# Altium project NXP_FRDM_IMX93.PrjPcb (part 9 of 13)
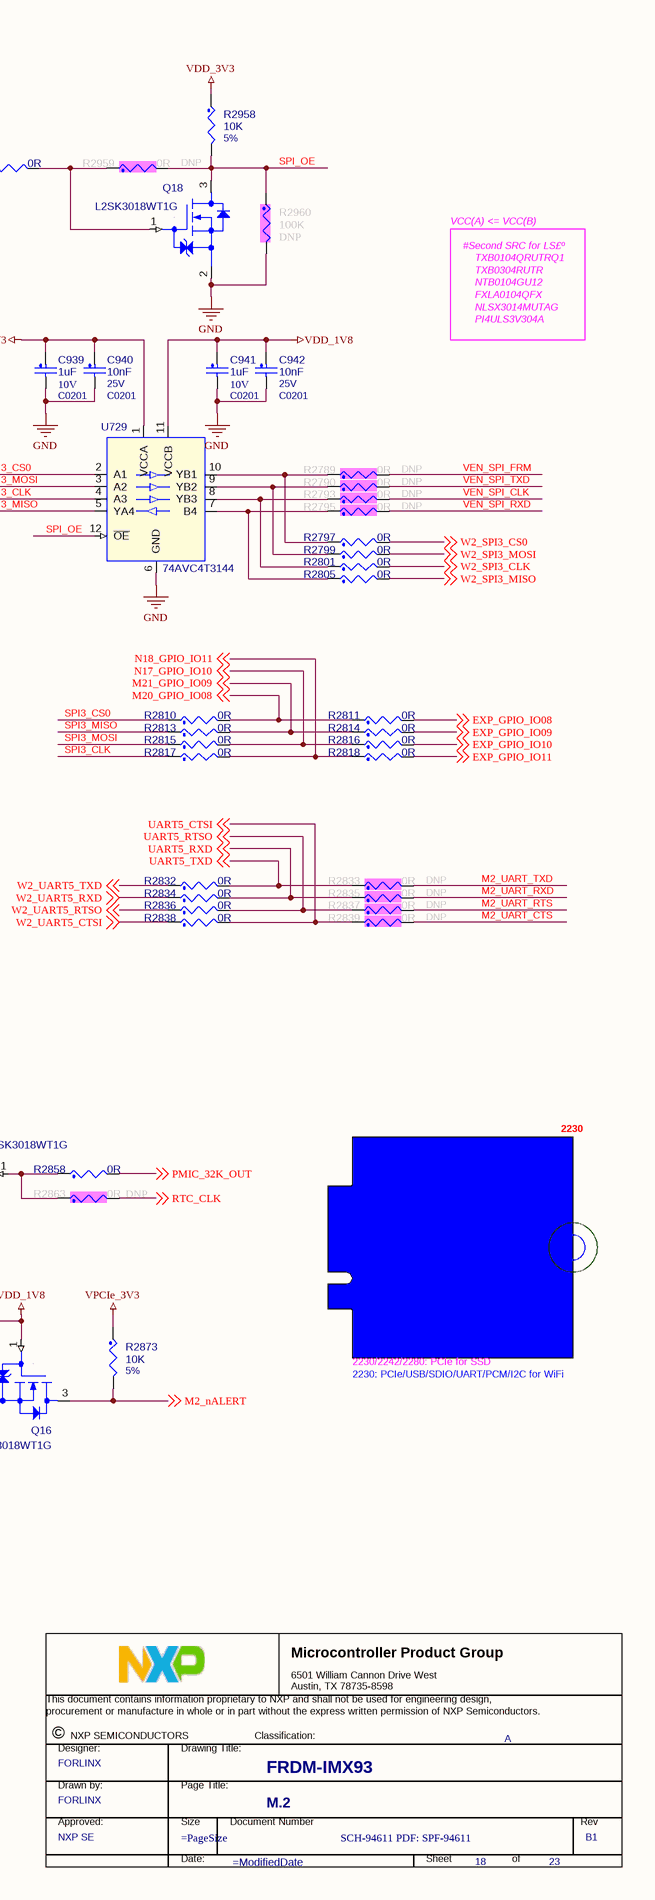
[diagram p44: E-18 M.2.SchDoc, right]

## Sheet E-18 M.2.SchDoc: FRDM-IMX93 (continued)

### Nets
GND: BH1.1 C927.2 C928.2 C930.2 C931.2 C932.2 C934.2 C935.2 C936.2 C937.2 C938.2 C939.2 C940.2 C941.2 C942.2 C943.2 C944.2 C945.2 C946.2 C947.2 C948.2 C949.2 C950.2 P8.1(GND1) P8.7(GND2) P8.18(GND3) P8.33(GND5) P8.39(GND4) P8.45(GND6) P8.51(GND7) P8.57(GND8) P8.63(GND9) P8.69(GND10) P8.75(GND11) Q8.2(SOURCE) Q17.2(SOURCE) Q18.2(SOURCE) R2783.2 R2784.2 R2956.2 R2960.2 U726.10(GND) U728.6(GND) U729.6(GND)
VDD_1V8: C937.1 C938.1 C941.1 C942.1 Q16.1(GATE) R2822.1 R2823.1 R2861.2 R2862.2 R2954.1 U728.11(VCCB) U729.11(VCCB)  [project net LPD4/x_VDD1]
VDD_3V3: C935.1 C936.1 C939.1 C940.1 R2785.1 R2957.1 R2958.1 U728.1(VCCA) U729.1(VCCA)
VDD_5V: C927.1 C928.1 R2786.1 U726.8(VIN1) U726.11(VIN2)
VPCIe_3V3: C929.1 C930.1 C931.1 C932.1 C933.2 C943.1 C944.1 C945.1 C946.1 C947.1 C948.1 C949.1 C950.1 L711.2 P8.2(3V3_1) P8.4(3V3_2) P8.72(3V3_3) P8.74(3V3_4) R2776.1 R2831.2 R2840.2 R2850.1 R2859.2 R2873.1 R3031.2 U726.2(OUT)
A15_USB2_D_N: R2804.1 R2807.1 ; off-sheet A15_USB2_D_N  [project net USB2_DN]
A22_SD3_nWAKE: R2851.1 R2854.1 R2862.1 ; off-sheet A22_SD3_nWAKE  [project net CLKO01]
B15_USB2_D_P: R2803.1 R2806.1 ; off-sheet B15_USB2_D_P  [project net USB2_DP]
EXP_GPIO_IO08: R2811.2 ; off-sheet EXP_GPIO_IO08
EXP_GPIO_IO09: R2814.2 ; off-sheet EXP_GPIO_IO09
EXP_GPIO_IO10: R2816.2 ; off-sheet EXP_GPIO_IO10
EXP_GPIO_IO11: R2818.2 ; off-sheet EXP_GPIO_IO11
EXT1_PWREN: R2781.1 ; off-sheet EXT1_PWREN
G20_SAI1_TXC: U728.2(A1) ; off-sheet G20_SAI1_TXC  [project net SAI1_TXC]
G21_SAI1_TXFS: U728.3(A2) ; off-sheet G21_SAI1_TXFS  [project net #BOOT_MODE2]
H20_SAI1_RXD0: U728.5(YA4) ; off-sheet H20_SAI1_RXD0  [project net SAI1_RXD0]
H21_SAI1_TXD0: U728.4(A3) ; off-sheet H21_SAI1_TXD0  [project net #BOOT_MODE3]
M2_DIS1: P8.56(~{W_DISABLE1}) R2866.2
M2_DIS2: P8.54(~{W_DISABLE2}) R2867.2
M2_I2C_SCL: P8.60(I2C_CLK) R2857.1
M2_I2C_SDA: P8.58(I2C_DATA) R2856.1
M2_LED1#: D613.C(CATHODE) P8.6(~{LED1})
M2_LED2#: D614.C(CATHODE) P8.16(~{LED2})
M2_nALERT: Q16.3(DRAIN) R2873.2 ; off-sheet M2_nALERT
M2_nDIS1: R2782.1 R2866.1 R2870.1 ; off-sheet M2_nDIS1
M2_nDIS2: Q17.1(GATE) R2867.1 R2871.1 R2955.1 ; off-sheet M2_nDIS2
M2_nPERST: P8.52(~{PERST0}) R2865.1
M2_nRST: R2865.2 ; off-sheet M2_nRST
M2_PCM_CLK: P8.8(I2S_SCK) R2788.2
M2_PCM_IN: P8.12(I2S_SD_IN) R2794.2
M2_PCM_OUT: P8.14(I2S_SD_OUT) R2792.2
M2_PCM_SYNC: P8.10(I2S_WS) R2791.2
M2_PWRON: C934.1 R2781.2 R2782.2 R2783.1 R2785.2 U726.5(EN)
M2_SD_CLK: P8.9(SDIO_CLK) R2824.2
M2_SD_CMD: P8.11(SDIO_CMD) R2823.2 R2825.2
M2_SD_DATA0: P8.13(SDIO_DATA0) R2822.2 R2826.2
M2_SD_DATA1: P8.15(SDIO_DATA1) R2827.2
M2_SD_DATA2: P8.17(SDIO_DATA2) R2828.2
M2_SD_DATA3: P8.19(SDIO_DATA3) R2829.2
M2_SD_nRST: P8.23(~{SDIO_RST}) R3037.2
M2_SD_nWAKE: P8.21(~{SDIO_WAKE}) R2851.2
M2_UART_CTS: P8.34(UART_CTS) R2839.2
M2_UART_nWAKE: P8.20(~{UART_WAKE}) R2853.2
M2_UART_RTS: P8.36(UART_RTS) R2837.2
M2_UART_RXD: P8.22(UART_RXD) R2835.2
M2_UART_TXD: P8.32(UART_TXD) R2833.2
M2_USB_DN: P8.5(USB_D-) R2807.2
M2_USB_DP: P8.3(USB_D+) R2806.2
M20_GPIO_IO08: R2810.2 R2811.1 ; off-sheet M20_GPIO_IO08  [project net GPIO_IO08]
M21_GPIO_IO09: R2813.2 R2814.1 ; off-sheet M21_GPIO_IO09  [project net GPIO_IO09]
N17_GPIO_IO10: R2815.2 R2816.1 ; off-sheet N17_GPIO_IO10  [project net GPIO_IO10]
N18_GPIO_IO11: R2817.2 R2818.1 ; off-sheet N18_GPIO_IO11  [project net GPIO_IO11]
PCIE_nWAKE: R2868.1 ; off-sheet PCIE_nWAKE
PMIC_32K_OUT: R2858.2 ; off-sheet PMIC_32K_OUT
PMIC_SCLL: R2857.2 ; off-sheet PMIC_SCLL
PMIC_SDAL: R2856.2 ; off-sheet PMIC_SDAL
RTC_CLK: R2863.2 ; off-sheet RTC_CLK
SAI1_OE: Q17.3(DRAIN) R2955.2 R2956.1 R2957.2 U728.12(~{OE})
SD3_nRST: R3037.1 R3038.1 ; off-sheet SD3_nRST
SPI3_CLK: R2817.1 U729.4(A3)
SPI3_CS0: R2810.1 U729.2(A1)
SPI3_MISO: R2813.1 U729.5(YA4)
SPI3_MOSI: R2815.1 U729.3(A2)
SPI3_SW_EN: R2961.1 ; off-sheet SPI3_SW_EN
SPI_OE: Q18.3(DRAIN) R2958.2 R2959.2 R2960.1 U729.12(~{OE})
SUSCLK: P8.50(SUSCLK) R2852.1
T14_SD3_DATA3: R2821.1 R2829.1 ; off-sheet T14_SD3_DATA3  [project net SD3_DATA3]
T16_SD3_DATA0: R2812.1 R2826.1 ; off-sheet T16_SD3_DATA0  [project net SD3_DATA0]
U14_SD3_DATA2: R2820.1 R2828.1 ; off-sheet U14_SD3_DATA2  [project net SD3_DATA2]
U16_SD3_CMD: R2809.1 R2825.1 ; off-sheet U16_SD3_CMD  [project net SD3_CMD]
UART5_CTSI: R2838.2 R2839.1 R3018.2 ; off-sheet UART5_CTSI
UART5_RTSO: R2836.2 R2837.1 R3017.2 ; off-sheet UART5_RTSO
UART5_RXD: R2834.2 R2835.1 R2841.2 ; off-sheet UART5_RXD
UART5_TXD: R2830.2 R2832.2 R2833.1 ; off-sheet UART5_TXD
UART_nWAKE: R2853.1 R2855.1 R2859.1 ; off-sheet UART_nWAKE
USB2_HOST_DN: R2804.2 ; off-sheet USB2_HOST_DN
USB2_HOST_DP: R2803.2 ; off-sheet USB2_HOST_DP
V14_SD3_DATA1: R2819.1 R2827.1 ; off-sheet V14_SD3_DATA1  [project net SD3_DATA1]
V16_SD3_CLK: R2808.1 R2824.1 ; off-sheet V16_SD3_CLK  [project net SD3_CLK]
VEN_SPI_CLK: P8.42(VEN_DEF3) R2793.2
VEN_SPI_FRM: R2789.2 R2864.2
VEN_SPI_RXD: P8.40(VEN_DEF2) R2795.2
VEN_SPI_TXD: P8.38(VEN_DEF1) R2790.2
W1_JTAG_TDI: R2841.1 ; off-sheet W1_JTAG_TDI  [project net JTAG_TDI]
W2_BT_154_RST: R2871.2 ; off-sheet W2_BT_154_RST
W2_BT_154_WAKE_HOST: R2855.2 ; off-sheet W2_BT_154_WAKE_HOST
W2_JTAG_TMS: R3017.1 ; off-sheet W2_JTAG_TMS  [project net JTAG_TMS]
W2_nDIS1: R2870.2 ; off-sheet W2_nDIS1
W2_PCM_CLK: R2796.2 ; off-sheet W2_PCM_CLK
W2_PCM_IN: R2802.2 ; off-sheet W2_PCM_IN  [project net W2_PCM_DIN]
W2_PCM_OUT: R2800.2 ; off-sheet W2_PCM_OUT  [project net W2_PCM_DOUT]
W2_PCM_SYNC: R2798.2 ; off-sheet W2_PCM_SYNC
W2_SD_CLK: R2808.2 ; off-sheet W2_SD_CLK
W2_SD_CMD: R2809.2 ; off-sheet W2_SD_CMD
W2_SD_DATA0: R2812.2 ; off-sheet W2_SD_DATA0  [project net W2_SD_DAT0]
W2_SD_DATA1: R2819.2 ; off-sheet W2_SD_DATA1  [project net W2_SD_DAT1]
W2_SD_DATA2: R2820.2 ; off-sheet W2_SD_DATA2  [project net W2_SD_DAT2]
W2_SD_DATA3: R2821.2 ; off-sheet W2_SD_DATA3  [project net W2_SD_DAT3]
W2_SPI3_CLK: R2801.2 ; off-sheet W2_SPI3_CLK  [project net W2_SPI_CLK]
W2_SPI3_CS0: R2797.2 ; off-sheet W2_SPI3_CS0  [project net W2_SPI_FRM]
W2_SPI3_MISO: R2805.2 ; off-sheet W2_SPI3_MISO  [project net W2_SPI_RX]
W2_SPI3_MOSI: R2799.2 ; off-sheet W2_SPI3_MOSI  [project net W2_SPI_TX]
W2_SPI_nINT: R3028.1 ; off-sheet W2_SPI_nINT
W2_UART5_CTSI: R2838.1 ; off-sheet W2_UART5_CTSI  [project net W2_UART_CTS]
W2_UART5_RTSO: R2836.1 ; off-sheet W2_UART5_RTSO  [project net W2_UART_RTS]
W2_UART5_RXD: R2834.1 ; off-sheet W2_UART5_RXD  [project net W2_UART_RX]
W2_UART5_TXD: R2832.1 ; off-sheet W2_UART5_TXD  [project net W2_UART_TX]
W2_WL_RST: R3038.2 ; off-sheet W2_WL_RST  [project net WL_RST]
WL_WAKE_HOST: R2854.2 ; off-sheet WL_WAKE_HOST
Y1_JTAG_TCK: R3018.1 ; off-sheet Y1_JTAG_TCK  [project net JTAG_TCK]
Y2_JTAG_TDO: R2830.1 ; off-sheet Y2_JTAG_TDO  [project net JTAG_TDO]
NetC929_2: C929.2 R2776.2 R2784.1 U726.3(FB)
NetC933_1: C933.1 U726.4(RAMP)
NetD613_A: D613.A(ANODE) R2831.1
NetD614_A: D614.A(ANODE) R2840.1
NetL711_1: L711.1 U726.1(SW1) U726.9(SW2)
NetP8_55: P8.55(~{PEWAKE0}) R2868.2 R3031.1
NetP8_62: P8.62(~{ALERT}) R2860.1
NetP8_64: P8.64(RESERVED) R2861.1 R2864.1
NetQ8_1: Q8.1(GATE) R2858.1 R2863.1
NetQ8_3: Q8.3(DRAIN) R2850.2 R2852.2
NetQ16_2: Q16.2(SOURCE) R2860.2 R2954.2 R3028.2
NetQ18_1: Q18.1(GATE) R2959.1 R2961.2
NetR2786_2: R2786.2 U726.6(MODE/VCON)
NetR2788_1: R2788.1 R2796.1 U728.10(YB1)
NetR2789_1: R2789.1 R2797.1 U729.10(YB1)
NetR2790_1: R2790.1 R2799.1 U729.9(YB2)
NetR2791_1: R2791.1 R2798.1 U728.9(YB2)
NetR2792_1: R2792.1 R2800.1 U728.8(YB3)
NetR2793_1: R2793.1 R2801.1 U729.8(YB3)
NetR2794_1: R2794.1 R2802.1 U728.7(B4)
NetR2795_1: R2795.1 R2805.1 U729.7(B4)
NetTP934_1: TP934.1(Pin1) U726.7(PG)

Not connected (* = marked no-connect by the designer): P8 35(PET_P0)* 37(PET_N0)* 41(PER_P0)* 43(PER_N0)* 44(COEX3)* 46(COEX2)* 47(REFCLK_P0)* 48(COEX1)* 49(REFCLK_N0)* 53(~{CLKREQ0})* 59(PET_P1)* 61(PET_N1)* 65(PER_P1)* 66(~{PERST1}) 67(PER_N1)* 68(~{CLKREQ1}) 70(~{PEWAKE1}) 71(REFCLK_P1)* 73(REFCLK_N1)*

### Layout directives
differential pair: M2_USB_DN, M2_USB_DP

### Notes on the sheet
- M.2 KEY-E
- # 3.3V/4A
- (near R2776) Ru
- VCC(A) <= VCC(B)
- #Second SRC for LS£º
- (near C933) Vfb=0.6V
- (near R2784) Vout = (Rd+Ru) * Vfb / Rd
- NLSX3014MUTAG
- NTB0104GU12
- TXB0304RUTR
- FXLA0104QFX
- TXB0104QRUTRQ1
- # Discharge Resistor: 150 OHM
- (near R2784) Rd
- PI4ULS3V304A
- (near R2786) MODE:
  >1.2V PWM
  <0.4V PFM
- M.2 / NGFF
- # Current Consumption Limit Peak: 2500mA
- DIM:  2230/2242/2280
- RSV for Modem/WiFi/BT/SSD
- Z:90 OHM
- (near D613) WLAN STAT
- (near P8) o
- (near P8) i
- (near D614) BT STAT
- #PCM: MASTER/SLAVE SUPPORT
- #VEN_DEF/RSV: 1.8V DOMAIN, SPI/UART for IEEE802.15.4
- (near P8) i/o
- 2230
- (near R2864) # PIN64 has been defined as VIO-1.8V from M.2 4.0
  SPEC, R957 kept as the compatible design
- (near P8) APCI0452-P001A
- # Ultra height reserved for M.2 expansion adapter board
- H:6.85MM
- M.2 SCREW
- # DEFAULT M.2 MODULE:
- NXP IW61X
- 2230: PCIe/USB/SDIO/UART/PCM/I2C for WiFi
- 2230/2242/2280: PCIe for SSD
- Key ID
- Pin
- Interface
- Key Definition
- i.MX93 GPIO8-11
- #GPIO_IO09
- #GPIO_IO08
- #SPI3_MISO
- #SPI3_CS
- #UART7_TXD
- #UART7_RXD
- #GPIO_IO11
- #GPIO_IO10
- #SPI3_CLK
- #SPI3_MOSI
- #UART7_RTS <O>
- #UART7_CTS <I>
- IW61X GPIO12-15
- #GPIO_IO15
- #SPI_TXD
- #UART2_SOUT
- A
  B
  C
  D
  E
  F
  G
  H
  J
  K
  L
  M
- 8-15
  12-19
  16-23
  20-27
  24-31
  28-35
  39-46
  43-50
  47-54
  51-58
  55-62
  59-66
- 2x PCIe x1 / USB 2.0 / I2C / DP x4
  PCIe x2 / SATA / USB 2.0 / USB 3.1 Gen1 / HSIC / SSIC / Audio / UIM / I2C / SMBus
  PCIe/M-PCIe  / USB 2.0 / USB 3.1 Gen1 / SSIC / I2C-SlimBUS / UIM / ANTCTL
  Reserved for Future Use (RFU)
  2x PCIe x1 / USB 2.0 / I2C / SDIO / UART / PCM
  Future Memory Interface (FMI)
  Not Used for M.2; for Custom/Non-Standard Apps
  Reserved for Future Use (RFU)
  Reserved for Future Use (RFU)
  Reserved for Future Use (RFU)
  Reserved for Future Use (RFU)
  PCIe x4 / SATA / SMBus
- Display Port Based Connectivity
  WWAN/SSD/Others Primary Key
  WWAN Key
  RFU
  SDIO Based Connectivity
  Future Memory Interface
  Generic (Not used for M.2)
  RFU
  RFU
  RFU
  RFU
  SSD 4 Lane PCIe
- #GPIO_IO12
- #GPIO_IO13
- #GPIO_IO14
- #SPI_CLK
- #SPI_FRM
- #SPI_RXD
- #UART2_RTS <O>
- #UART2_SIN
- #UART2_CTS <I>
- DWG. NO.
- REV.
- SHT.
- REVISION
- DESCRIPTION
- DATE
- APPROVED
- ENG:
- APPROVALS
- quilter.ai <http://quilter.ai>
- DSN:
- CHK:
- REFERENCE DOCUMENTS
- TITLE
- PROJECT
- BOM:
- FAB DWG:
- PCB DWG:
- ASSY DWG:
- SIZE
- FILE NAME
- C
- DWG NO.
- SHEET
- OF
- REV
- (in symbol CON_67_FEMALE_RA_B) M.2 / NGFF; KEY E; 1.8V
- (in symbol TitleBlock_MCPG) Microcontroller Product Group; 6501 William Cannon Drive West / Austin, TX 78735-8598; This document contains information proprietary to NXP and shall not be used for engineering design,; procurement or manufacture in whole or in part without the express written permission of NXP Semiconductors.; ©; NXP SEMICONDUCTORS; Classification:; Designer:; Drawing Title:; Drawn by:; Page Title:; Approved:; Size; Document Number; Rev; Date:; Sheet; of

### Library data of the parts
*#18 = TitleBlock_MCPG: Classification: Public, Company Internal/Proprietary, Company Confidential,  Company Secret; OrgName: NXP Semiconductor; OrgAddr1: NO. 192 Liangjing Rd. Pudong New Area, ShangHai; Page Size: =PageSize; Page Create Date: March  8, 1995; Designer: FORLINX; Page Modify Date: =ModifiedDate
BH1 = MOUNT_HOLE: M2mm,long 4mm; Part Reference: BH1; CLASS: IC; CAD_APPROVED: Yes; MFG_NAME01: SINHOO; MFG_PN01: M2*4mm; Value: SMTSO-M2.5-5ET; HEIGHT: 5.13MM; ROHS: Yes; PCB Footprint: mh244-166t_202h
C927 = CAP_NP: 0201,100nF,25V,+/-10%,X5R; Part Reference: C927; CLASS: DISCRETE; FPLIST: CC0402_25,CC0402_HD,0402_CC,capc0402_l; CAD_APPROVED: Yes; MFG_PN01: 0201X104K250NT; MFG_NAME01: FENGHUA; Tolerance: 10%; Value: 100nF; HEIGHT: 0.55MM; ROHS: Yes; PCB Footprint: C0201
C928 = CAP_NP: 0805,47uF,10V,+/-20%,X5R; Part Reference: C928; CLASS: DISCRETE; FPLIST: CC1210,1210_CC; CAD_APPROVED: Yes; MFG_PN01: GRM21BR61A476ME15L; MFG_NAME01: MURATA; Tolerance: 20%; Value: 47uF; Package Size: 1210; HEIGHT: 2.8MM; ROHS: Yes; PCB Footprint: C0805
C929 = CAP_NP: 0402,1nF,50V,+/-10%,X7R; Part Reference: C929; CLASS: DISCRETE; Tolerance: 5%; MFG_NAME01: FENGHUA; MFG_PN01: 0402B102K500NT; CAD_APPROVED: Yes; FPLIST: CC0402_25,CC0402_HD,0402_CC; Value: 1000pF; ROHS: Yes; HEIGHT: 0.55MM; PCB Footprint: C0402
C930 = CAP_NP: 0603,22uF,6.3V,+/-20%,X5R; Part Reference: C930; CLASS: DISCRETE; Tolerance: 20%; MFG_NAME01: SAMSUNG; MFG_PN01: CL10A226MQ8NRNC; CAD_APPROVED: Yes; FPLIST: CC0805_OV,CC0805,0805_CC; Value: 22uF; ROHS: Yes; HEIGHT: 1.45MM; PCB Footprint: C0603
C931 = CAP_NP: 0603,22uF,6.3V,+/-20%,X5R; Part Reference: C931; CLASS: DISCRETE; Tolerance: 20%; MFG_NAME01: SAMSUNG; MFG_PN01: CL10A226MQ8NRNC; CAD_APPROVED: Yes; FPLIST: CC0805_OV,CC0805,0805_CC; Value: 22uF; ROHS: Yes; HEIGHT: 1.45MM; PCB Footprint: C0603
C932 = CAP_NP: 0201,100nF,25V,+/-10%,X5R; Part Reference: C932; CLASS: DISCRETE; MFG_PN01: 0201X104K250NT; MFG_NAME01: FENGHUA; CAD_APPROVED: Yes; Tolerance: 10%; FPLIST: CC0402_25,CC0402_HD,0402_CC,capc0402_l; Value: 100nF; ROHS: Yes; HEIGHT: 0.55MM; PCB Footprint: C0201
C933 = CAP_NP: 0402,1nF,50V,+/-10%,X7R; Part Reference: C933; CLASS: DISCRETE; FPLIST: CC0402_25,CC0402_HD,0402_CC; CAD_APPROVED: Yes; MFG_PN01: 0402B102K500NT; MFG_NAME01: FENGHUA; Tolerance: 5%; Value: 1000pF; HEIGHT: 0.55MM; ROHS: Yes; PCB Footprint: C0402
C934 = CAP_NP: 0402,100nF,50V,+/-10%,X5R; Part Reference: C934; CLASS: DISCRETE; Tolerance: 10%; MFG_NAME01: FENGHUA; MFG_PN01: 0402X104K500NT; CAD_APPROVED: Yes; FPLIST: CC0402_25,CC0402_HD,0402_CC,capc0402_l; Value: 100nF; ROHS: Yes; HEIGHT: 0.55MM; PCB Footprint: C0402
C935 = CAP_NP: 0201,1uF,10V,+/-20%,X5R; Part Reference: C935; CLASS: DISCRETE; Tolerance: 10%; SIGNAL_MODEL: DEFAULT_CAPACITOR_1e+06pF_2_1; MFG_NAME01: SAMSUNG; MFG_PN01: CL03A105MP3NSNC; CAD_APPROVED: Yes; FPLIST: CC0402_25,CC0402_HD,0402_CC,capc0402_l; Value: 1uF; ROHS: Yes; HEIGHT: 0.55 MM; TOL: 10%; voltage rating: 10V; PCB Footprint: C0201
C936 = CAP_NP: 0201,10nF,25V,+/-10%,X7R; Part Reference: C936; CLASS: DISCRETE; Tolerance: 10%; MFG_NAME01: FENGHUA; MFG_PN01: 0201B103K250NT; Temp_Range: -55¡ãC - 85¡ãC; CAD_APPROVED: Yes; FPLIST: CC0402_25,CC0402_HD,0402_CC,capc0402_l; Value: 10nF; ROHS: Yes; HEIGHT: 0.55MM; PCB Footprint: C0201
C937 = CAP_NP: 0201,10nF,25V,+/-10%,X7R; Part Reference: C937; CLASS: DISCRETE; Tolerance: 10%; MFG_NAME01: FENGHUA; MFG_PN01: 0201B103K250NT; Temp_Range: -55¡ãC - 85¡ãC; CAD_APPROVED: Yes; FPLIST: CC0402_25,CC0402_HD,0402_CC,capc0402_l; Value: 10nF; ROHS: Yes; HEIGHT: 0.55MM; PCB Footprint: C0201
C938 = CAP_NP: 0201,1uF,10V,+/-20%,X5R; Part Reference: C938; CLASS: DISCRETE; Tolerance: 10%; SIGNAL_MODEL: DEFAULT_CAPACITOR_1e+06pF_2_1; MFG_NAME01: SAMSUNG; MFG_PN01: CL03A105MP3NSNC; CAD_APPROVED: Yes; FPLIST: CC0402_25,CC0402_HD,0402_CC,capc0402_l; Value: 1uF; ROHS: Yes; HEIGHT: 0.55 MM; TOL: 10%; voltage rating: 10V; PCB Footprint: C0201
C939 = CAP_NP: 0201,1uF,10V,+/-20%,X5R; Part Reference: C939; CLASS: DISCRETE; Tolerance: 10%; SIGNAL_MODEL: DEFAULT_CAPACITOR_1e+06pF_2_1; MFG_NAME01: SAMSUNG; MFG_PN01: CL03A105MP3NSNC; CAD_APPROVED: Yes; FPLIST: CC0402_25,CC0402_HD,0402_CC,capc0402_l; Value: 1uF; ROHS: Yes; HEIGHT: 0.55 MM; TOL: 10%; voltage rating: 10V; PCB Footprint: C0201
C940 = CAP_NP: 0201,10nF,25V,+/-10%,X7R; Part Reference: C940; CLASS: DISCRETE; FPLIST: CC0402_25,CC0402_HD,0402_CC; CAD_APPROVED: Yes; MFG_PN01: 0201B103K250NT; MFG_NAME01: FENGHUA; Tolerance: 10%; Value: 10nF; HEIGHT: 0.74 MM; ROHS: Yes; PCB Footprint: C0201
C941 = CAP_NP: 0201,1uF,10V,+/-20%,X5R; Part Reference: C941; CLASS: DISCRETE; Tolerance: 10%; SIGNAL_MODEL: DEFAULT_CAPACITOR_1e+06pF_2_1; MFG_NAME01: SAMSUNG; MFG_PN01: CL03A105MP3NSNC; CAD_APPROVED: Yes; FPLIST: CC0402_25,CC0402_HD,0402_CC,capc0402_l; Value: 1uF; ROHS: Yes; HEIGHT: 0.55 MM; TOL: 10%; voltage rating: 10V; PCB Footprint: C0201
C942 = CAP_NP: 0201,10nF,25V,+/-10%,X7R; Part Reference: C942; CLASS: DISCRETE; FPLIST: CC0402_25,CC0402_HD,0402_CC; CAD_APPROVED: Yes; MFG_PN01: 0201B103K250NT; MFG_NAME01: FENGHUA; Tolerance: 10%; Value: 10nF; HEIGHT: 0.74 MM; ROHS: Yes; PCB Footprint: C0201
C943 = CAP_NP: 0201,100nF,25V,+/-10%,X5R; Part Reference: C943; CLASS: DISCRETE; FPLIST: CC0402_25,CC0402_HD,0402_CC,capc0402_l; CAD_APPROVED: Yes; MFG_PN01: 0201X104K250NT; MFG_NAME01: FENGHUA; Tolerance: 10%; Value: 100nF; HEIGHT: 0.55MM; ROHS: Yes; PCB Footprint: C0201
C944 = CAP_NP: 0201,100nF,25V,+/-10%,X5R; Part Reference: C944; CLASS: DISCRETE; FPLIST: CC0402_25,CC0402_HD,0402_CC,capc0402_l; CAD_APPROVED: Yes; MFG_PN01: 0201X104K250NT; MFG_NAME01: FENGHUA; Tolerance: 10%; Value: 100nF; HEIGHT: 0.55MM; ROHS: Yes; PCB Footprint: C0201
C945 = CAP_NP: 0201,100nF,25V,+/-10%,X5R; Part Reference: C945; CLASS: DISCRETE; Tolerance: 10%; MFG_NAME01: FENGHUA; MFG_PN01: 0201X104K250NT; CAD_APPROVED: Yes; FPLIST: CC0402_25,CC0402_HD,0402_CC,capc0402_l; Value: 100nF; ROHS: Yes; HEIGHT: 0.55MM; PCB Footprint: C0201
C946 = CAP_NP: 0201,100nF,25V,+/-10%,X5R; Part Reference: C946; CLASS: DISCRETE; Tolerance: 10%; MFG_NAME01: FENGHUA; MFG_PN01: 0201X104K250NT; CAD_APPROVED: Yes; FPLIST: CC0402_25,CC0402_HD,0402_CC,capc0402_l; Value: 100nF; ROHS: Yes; HEIGHT: 0.55MM; PCB Footprint: C0201
C947 = CAP_NP: 0402,10uF,6.3V,+/-20%,X5R; Part Reference: C947; CLASS: DISCRETE; FPLIST: CC0603_OV,CC0603,0603_CC_NSP; CAD_APPROVED: Yes; Temp_Range: -55¡ãC ~ 85¡ãC; MFG_PN01: 0402X106M6R3NT; MFG_NAME01: FENGHUA; Tolerance: 20%; Value: 10uF; HEIGHT: 1MM; ROHS: Yes; Package Size: 0603; Package Type: SMD; PCB Footprint: C0402
C948 = CAP_NP: 1206,100uF,6.3V,+/-20%,X5R; Part Reference: C948; CLASS: DISCRETE; Tolerance: 20%; MFG_NAME01: SAMSUNG; MFG_PN01: CL31A107MQHNNNE; CAD_APPROVED: Yes; FPLIST: CC1210,1210_CC; Value: 100uF; ROHS: Yes; HEIGHT: 2.8MM; Package Size: 1210; PCB Footprint: C1206
C949 = CAP_NP: 1206,100uF,6.3V,+/-20%,X5R; Part Reference: C949; CLASS: DISCRETE; Tolerance: 20%; MFG_NAME01: SAMSUNG; MFG_PN01: CL31A107MQHNNNE; CAD_APPROVED: Yes; FPLIST: CC1210,1210_CC; Value: 100uF; ROHS: Yes; HEIGHT: 2.8MM; Package Size: 1210; PCB Footprint: C1206
C950 = CAP_NP: 1206,100uF,6.3V,+/-20%,X5R; Part Reference: C950; CLASS: DISCRETE; Tolerance: 20%; MFG_NAME01: SAMSUNG; MFG_PN01: CL31A107MQHNNNE; CAD_APPROVED: Yes; FPLIST: CC1210,1210_CC; Value: 100uF; ROHS: Yes; HEIGHT: 2.8MM; Package Size: 1210; PCB Footprint: C1206
D613 = LED: LED GRN SGL 25MA SMT 0603; Part Reference: D613; CLASS: IC; MFG_NAME01: Harvatek; MFG_PN01: HQ19-2132UBGC82(Y); CAD_APPROVED: Yes; VOLTAGE: 2V; Value: LED GREEN; ROHS: Yes; HEIGHT: 0.8 MM; PCB Footprint: led0603
D614 = LED: LED BLUE SGL 20MA SMT 0603; Part Reference: D614; CLASS: IC; MFG_NAME01: Harvatek; MFG_PN01: HQ19-2132UBC83 (Y); Temp_Range: -40¡ãC to +85¡ãC; CAD_APPROVED: Yes; Rated Voltage: 2V; Value: LED_ORANGE; ROHS: Yes; HEIGHT: 0.28MM; VOLTAGE: 2v; Temp Range: -40¡ãC to +85¡ãC; PCB Footprint: led0603
L711 = INDUCTOR: 0.47uh, 2.5*2.0*1.0mm ,4.4A; Part Reference: L711; PART_TYPE: INDUCTOR\POWER; CLASS: DISCRETE; TOL: 20%; MFG_NAME01: Sunlord; MFG_PN01: WPN252012ER47MT; Temp_Range: -40¡ãC to +125¡ãC; CAD_APPROVED: Yes; Value: 0.47uH; ROHS: Yes; HEIGHT: 1.2MM; Tolerance: 20%; PCB Footprint: ind_sph2520
P8 = CON_67_FEMALE_RA_B: AP-APC1037-1,M.2,0.5PITCH,5.5mm,Support height of 3.9mm,KEY-E; Part Reference: P8; CLASS: IO; CAD_APPROVED: Yes; MFG_NAME01: LOTES; 3D_Mechanical_Footprint_File: ftp://fcl.am.freescale.net/ALLEGRO/step/con67_0p5_type-e_22x7p3_ra_270h.STEP; Value: M.2 SKT KEY-E; Package Size: 22.0 x 7.3 x 6.85 mm; HEIGHT: 6.85MM; Package Type: SMD/SMT; ROHS: Yes; MFG_PN01: AP-APC1037-1; PCB Footprint: con_75_0p5_22x9_ra1
Q8 = NX3008NBKW_SOT323: Part Reference: Q8; CLASS: IC; MFG_NAME01: LRC; CAD_APPROVED: Yes; Value: L2SK3018WT1G; MFG_PN01: L2SK3018WT1G; ROHS: Yes; HEIGHT: 1.1MM; PCB Footprint: sc70_3
Q16 = NX3008NBKW_SOT323: Part Reference: Q16; CLASS: IC; CAD_APPROVED: Yes; MFG_NAME01: LRC; Value: L2SK3018WT1G; HEIGHT: 1.1MM; ROHS: Yes; MFG_PN01: L2SK3018WT1G; PCB Footprint: sc70_3
Q17 = NX3008NBKW_SOT323: Part Reference: Q17; CLASS: IC; CAD_APPROVED: Yes; MFG_NAME01: LRC; Value: L2SK3018WT1G; HEIGHT: 1.1MM; ROHS: Yes; MFG_PN01: L2SK3018WT1G; PCB Footprint: sc70_3
Q18 = NX3008NBKW_SOT323: Part Reference: Q18; CLASS: IC; MFG_NAME01: LRC; CAD_APPROVED: Yes; Value: L2SK3018WT1G; MFG_PN01: L2SK3018WT1G; ROHS: Yes; HEIGHT: 1.1MM; PCB Footprint: sc70_3
R2776 = RES: 0402,187K,+/-1%; Part Reference: R2776; CLASS: DISCRETE; FPLIST: RC0402_25,RC0402_HD,0402_CC; CAD_APPROVED: Yes; Temp_Range: -55C to +155C; MFG_PN01: RC-02W1873FT; MFG_NAME01: FENGHUA; Value: 187K; HEIGHT: 0.40 MM; ROHS: Yes; PCB Footprint: R0402
R2781 = RES: 0201,1K,+/-1%; Part Reference: R2781; CLASS: DISCRETE; FPLIST: RC0402_25,RC0402_HD,RC0402_X2,0402_CC,CAPC0402_L; CAD_APPROVED: Yes; MFG_PN01: RC-01W1001FT; MFG_NAME01: FENGHUA; Value: 1K; ROHS: Yes; HEIGHT: 0.41mm; PCB Footprint: R0201
R2782 = RES: 0201,1K,+/-1%; Part Reference: R2782; CLASS: DISCRETE; MFG_NAME01: FENGHUA; MFG_PN01: RC-01W1001FT; CAD_APPROVED: Yes; FPLIST: RC0402_25,RC0402_HD,RC0402_X2,0402_CC,CAPC0402_L; Value: 1K; HEIGHT: 0.41mm; ROHS: Yes; PCB Footprint: R0201
R2783 = RES: 0201,10K,+/-5%; Part Reference: R2783; CLASS: DISCRETE; FPLIST: RC0402_25,RC0402_HD,0402_CC; CAD_APPROVED: Yes; MFG_PN01: RC-01W103JT; MFG_NAME01: FENGHUA; Value: 10K; HEIGHT: 0.4 MM; ROHS: Yes; PCB Footprint: R0201
R2784 = RES: 0402,41.2K,+/-1%; Part Reference: R2784; CLASS: DISCRETE; MFG_NAME01: FENGHUA; MFG_PN01: RC-02W4122FT; Temp_Range: -55C to +155C; CAD_APPROVED: Yes; FPLIST: RC0402_25,RC0402_HD,0402_CC; Value: 41.2K; ROHS: Yes; HEIGHT: 0.40 MM; PCB Footprint: R0402
R2785 = RES: 0201,1K,+/-1%; Part Reference: R2785; CLASS: DISCRETE; FPLIST: RC0402_25,RC0402_HD,RC0402_X2,0402_CC,CAPC0402_L; CAD_APPROVED: Yes; MFG_PN01: RC-01W1001FT; MFG_NAME01: FENGHUA; Value: 1K; ROHS: Yes; HEIGHT: 0.41mm; PCB Footprint: R0201
R2786 = RES: 0201,100K,+/-1%; Part Reference: R2786; CLASS: DISCRETE; Temp_Range: -55C to +155C; FPLIST: RC0402_25,RC0402_HD,0402_CC; CAD_APPROVED: Yes; MFG_PN01: RC-01W1003FT; MFG_NAME01: FENGHUA; VOLTAGE: 50V; Value: 100K; HEIGHT: 0.40 MM; ROHS: Yes; Temp Range: -55C to +155C; PCB Footprint: R0201
R2788 = RES: 0402,0Ohm,+/-1%; Part Reference: R2788; CLASS: DISCRETE; FPLIST: RC0402_25,RC0402_HD,RC0402_X2,0402_CC; CAD_APPROVED: Yes; MFG_PN01: RC-02000FT; MFG_NAME01: FENGHUA; Tolerance: 5%; VOLTAGE: 1/16W; Value: 0R; ROHS: Yes; HEIGHT: 0.45 MM; PCB Footprint: R0402
R2789 = RES: 0402,0Ohm,+/-1%; Part Reference: R2789; CLASS: DISCRETE; FPLIST: RC0402_25,RC0402_HD,RC0402_X2,0402_CC; CAD_APPROVED: Yes; MFG_PN01: RC-02000FT; MFG_NAME01: FENGHUA; Tolerance: 5%; VOLTAGE: 1/16W; Value: 0R; ROHS: Yes; HEIGHT: 0.45 MM; PCB Footprint: R0402
R2790 = RES: 0402,0Ohm,+/-1%; Part Reference: R2790; CLASS: DISCRETE; VOLTAGE: 1/16W; Tolerance: 5%; MFG_NAME01: FENGHUA; MFG_PN01: RC-02000FT; CAD_APPROVED: Yes; FPLIST: RC0402_25,RC0402_HD,RC0402_X2,0402_CC; Value: 0R; HEIGHT: 0.45 MM; ROHS: Yes; PCB Footprint: R0402
R2791 = RES: 0402,0Ohm,+/-1%; Part Reference: R2791; CLASS: DISCRETE; VOLTAGE: 1/16W; Tolerance: 5%; MFG_NAME01: FENGHUA; MFG_PN01: RC-02000FT; CAD_APPROVED: Yes; FPLIST: RC0402_25,RC0402_HD,RC0402_X2,0402_CC; Value: 0R; HEIGHT: 0.45 MM; ROHS: Yes; PCB Footprint: R0402
R2792 = RES: 0402,0Ohm,+/-1%; Part Reference: R2792; CLASS: DISCRETE; VOLTAGE: 1/16W; Tolerance: 5%; MFG_NAME01: FENGHUA; MFG_PN01: RC-02000FT; CAD_APPROVED: Yes; FPLIST: RC0402_25,RC0402_HD,RC0402_X2,0402_CC; Value: 0R; HEIGHT: 0.45 MM; ROHS: Yes; PCB Footprint: R0402
R2793 = RES: 0402,0Ohm,+/-1%; Part Reference: R2793; CLASS: DISCRETE; FPLIST: RC0402_25,RC0402_HD,RC0402_X2,0402_CC; CAD_APPROVED: Yes; MFG_PN01: RC-02000FT; MFG_NAME01: FENGHUA; Tolerance: 5%; VOLTAGE: 1/16W; Value: 0R; ROHS: Yes; HEIGHT: 0.45 MM; PCB Footprint: R0402
R2794 = RES: 0402,0Ohm,+/-1%; Part Reference: R2794; CLASS: DISCRETE; VOLTAGE: 1/16W; Tolerance: 5%; MFG_NAME01: FENGHUA; MFG_PN01: RC-02000FT; CAD_APPROVED: Yes; FPLIST: RC0402_25,RC0402_HD,RC0402_X2,0402_CC; Value: 0R; HEIGHT: 0.45 MM; ROHS: Yes; PCB Footprint: R0402
R2795 = RES: 0402,0Ohm,+/-1%; Part Reference: R2795; CLASS: DISCRETE; FPLIST: RC0402_25,RC0402_HD,RC0402_X2,0402_CC; CAD_APPROVED: Yes; MFG_PN01: RC-02000FT; MFG_NAME01: FENGHUA; Tolerance: 5%; VOLTAGE: 1/16W; Value: 0R; ROHS: Yes; HEIGHT: 0.45 MM; PCB Footprint: R0402
R2796 = RES: 0402,0Ohm,+/-1%; Part Reference: R2796; CLASS: DISCRETE; FPLIST: RC0402_25,RC0402_HD,RC0402_X2,0402_CC; CAD_APPROVED: Yes; MFG_PN01: RC-02000FT; MFG_NAME01: FENGHUA; Tolerance: 5%; VOLTAGE: 1/16W; Value: 0R; ROHS: Yes; HEIGHT: 0.45 MM; PCB Footprint: R0402
R2797 = RES: 0402,0Ohm,+/-1%; Part Reference: R2797; CLASS: DISCRETE; VOLTAGE: 1/16W; Tolerance: 5%; MFG_NAME01: FENGHUA; MFG_PN01: RC-02000FT; CAD_APPROVED: Yes; FPLIST: RC0402_25,RC0402_HD,RC0402_X2,0402_CC; Value: 0R; HEIGHT: 0.45 MM; ROHS: Yes; PCB Footprint: R0402
R2798 = RES: 0402,0Ohm,+/-1%; Part Reference: R2798; CLASS: DISCRETE; FPLIST: RC0402_25,RC0402_HD,RC0402_X2,0402_CC; CAD_APPROVED: Yes; MFG_PN01: RC-02000FT; MFG_NAME01: FENGHUA; Tolerance: 5%; VOLTAGE: 1/16W; Value: 0R; ROHS: Yes; HEIGHT: 0.45 MM; PCB Footprint: R0402
R2799 = RES: 0402,0Ohm,+/-1%; Part Reference: R2799; CLASS: DISCRETE; FPLIST: RC0402_25,RC0402_HD,RC0402_X2,0402_CC; CAD_APPROVED: Yes; MFG_PN01: RC-02000FT; MFG_NAME01: FENGHUA; Tolerance: 5%; VOLTAGE: 1/16W; Value: 0R; ROHS: Yes; HEIGHT: 0.45 MM; PCB Footprint: R0402
R2800 = RES: 0402,0Ohm,+/-1%; Part Reference: R2800; CLASS: DISCRETE; FPLIST: RC0402_25,RC0402_HD,RC0402_X2,0402_CC; CAD_APPROVED: Yes; MFG_PN01: RC-02000FT; MFG_NAME01: FENGHUA; Tolerance: 5%; VOLTAGE: 1/16W; Value: 0R; ROHS: Yes; HEIGHT: 0.45 MM; PCB Footprint: R0402
R2801 = RES: 0402,0Ohm,+/-1%; Part Reference: R2801; CLASS: DISCRETE; FPLIST: RC0402_25,RC0402_HD,RC0402_X2,0402_CC; CAD_APPROVED: Yes; MFG_PN01: RC-02000FT; MFG_NAME01: FENGHUA; Tolerance: 5%; VOLTAGE: 1/16W; Value: 0R; ROHS: Yes; HEIGHT: 0.45 MM; PCB Footprint: R0402
R2802 = RES: 0402,0Ohm,+/-1%; Part Reference: R2802; CLASS: DISCRETE; FPLIST: RC0402_25,RC0402_HD,RC0402_X2,0402_CC; CAD_APPROVED: Yes; MFG_PN01: RC-02000FT; MFG_NAME01: FENGHUA; Tolerance: 5%; VOLTAGE: 1/16W; Value: 0R; ROHS: Yes; HEIGHT: 0.45 MM; PCB Footprint: R0402
R2803 = RES: 0402,0Ohm,+/-1%; Part Reference: R2803; CLASS: DISCRETE; VOLTAGE: 1/16W; Tolerance: 5%; MFG_NAME01: FENGHUA; MFG_PN01: RC-02000FT; CAD_APPROVED: Yes; FPLIST: RC0402_25,RC0402_HD,RC0402_X2,0402_CC; Value: 0R; HEIGHT: 0.45 MM; ROHS: Yes; PCB Footprint: R0402
R2804 = RES: 0402,0Ohm,+/-1%; Part Reference: R2804; CLASS: DISCRETE; VOLTAGE: 1/16W; Tolerance: 5%; MFG_NAME01: FENGHUA; MFG_PN01: RC-02000FT; CAD_APPROVED: Yes; FPLIST: RC0402_25,RC0402_HD,RC0402_X2,0402_CC; Value: 0R; HEIGHT: 0.45 MM; ROHS: Yes; PCB Footprint: R0402
R2805 = RES: 0402,0Ohm,+/-1%; Part Reference: R2805; CLASS: DISCRETE; VOLTAGE: 1/16W; Tolerance: 5%; MFG_NAME01: FENGHUA; MFG_PN01: RC-02000FT; CAD_APPROVED: Yes; FPLIST: RC0402_25,RC0402_HD,RC0402_X2,0402_CC; Value: 0R; HEIGHT: 0.45 MM; ROHS: Yes; PCB Footprint: R0402
R2806 = RES: 0402,0Ohm,+/-1%; Part Reference: R2806; CLASS: DISCRETE; VOLTAGE: 1/16W; Tolerance: 5%; MFG_NAME01: FENGHUA; MFG_PN01: RC-02000FT; CAD_APPROVED: Yes; FPLIST: RC0402_25,RC0402_HD,RC0402_X2,0402_CC; Value: 0R; HEIGHT: 0.45 MM; ROHS: Yes; PCB Footprint: R0402
R2807 = RES: 0402,0Ohm,+/-1%; Part Reference: R2807; CLASS: DISCRETE; VOLTAGE: 1/16W; Tolerance: 5%; MFG_NAME01: FENGHUA; MFG_PN01: RC-02000FT; CAD_APPROVED: Yes; FPLIST: RC0402_25,RC0402_HD,RC0402_X2,0402_CC; Value: 0R; HEIGHT: 0.45 MM; ROHS: Yes; PCB Footprint: R0402
R2808 = RES: 0402,0Ohm,+/-1%; Part Reference: R2808; CLASS: DISCRETE; FPLIST: RC0402_25,RC0402_HD,RC0402_X2,0402_CC; CAD_APPROVED: Yes; MFG_PN01: RC-02000FT; MFG_NAME01: FENGHUA; Tolerance: 5%; VOLTAGE: 1/16W; Value: 0R; ROHS: Yes; HEIGHT: 0.45 MM; PCB Footprint: R0402
R2809 = RES: 0402,0Ohm,+/-1%; Part Reference: R2809; CLASS: DISCRETE; FPLIST: RC0402_25,RC0402_HD,RC0402_X2,0402_CC; CAD_APPROVED: Yes; MFG_PN01: RC-02000FT; MFG_NAME01: FENGHUA; Tolerance: 5%; VOLTAGE: 1/16W; Value: 0R; ROHS: Yes; HEIGHT: 0.45 MM; PCB Footprint: R0402
R2810 = RES: 0402,0Ohm,+/-1%; Part Reference: R2810; CLASS: DISCRETE; FPLIST: RC0402_25,RC0402_HD,RC0402_X2,0402_CC; CAD_APPROVED: Yes; MFG_PN01: RC-02000FT; MFG_NAME01: FENGHUA; Tolerance: 5%; VOLTAGE: 1/16W; Value: 0R; ROHS: Yes; HEIGHT: 0.45 MM; PCB Footprint: R0402
R2811 = RES: 0402,0Ohm,+/-1%; Part Reference: R2811; CLASS: DISCRETE; FPLIST: RC0402_25,RC0402_HD,RC0402_X2,0402_CC; CAD_APPROVED: Yes; MFG_PN01: RC-02000FT; MFG_NAME01: FENGHUA; Tolerance: 5%; VOLTAGE: 1/16W; Value: 0R; ROHS: Yes; HEIGHT: 0.45 MM; PCB Footprint: R0402
R2812 = RES: 0402,0Ohm,+/-1%; Part Reference: R2812; CLASS: DISCRETE; FPLIST: RC0402_25,RC0402_HD,RC0402_X2,0402_CC; CAD_APPROVED: Yes; MFG_PN01: RC-02000FT; MFG_NAME01: FENGHUA; Tolerance: 5%; VOLTAGE: 1/16W; Value: 0R; ROHS: Yes; HEIGHT: 0.45 MM; PCB Footprint: R0402
R2813 = RES: 0402,0Ohm,+/-1%; Part Reference: R2813; CLASS: DISCRETE; VOLTAGE: 1/16W; Tolerance: 5%; MFG_NAME01: FENGHUA; MFG_PN01: RC-02000FT; CAD_APPROVED: Yes; FPLIST: RC0402_25,RC0402_HD,RC0402_X2,0402_CC; Value: 0R; HEIGHT: 0.45 MM; ROHS: Yes; PCB Footprint: R0402
R2814 = RES: 0402,0Ohm,+/-1%; Part Reference: R2814; CLASS: DISCRETE; VOLTAGE: 1/16W; Tolerance: 5%; MFG_NAME01: FENGHUA; MFG_PN01: RC-02000FT; CAD_APPROVED: Yes; FPLIST: RC0402_25,RC0402_HD,RC0402_X2,0402_CC; Value: 0R; HEIGHT: 0.45 MM; ROHS: Yes; PCB Footprint: R0402
R2815 = RES: 0402,0Ohm,+/-1%; Part Reference: R2815; CLASS: DISCRETE; VOLTAGE: 1/16W; Tolerance: 5%; MFG_NAME01: FENGHUA; MFG_PN01: RC-02000FT; CAD_APPROVED: Yes; FPLIST: RC0402_25,RC0402_HD,RC0402_X2,0402_CC; Value: 0R; HEIGHT: 0.45 MM; ROHS: Yes; PCB Footprint: R0402
R2816 = RES: 0402,0Ohm,+/-1%; Part Reference: R2816; CLASS: DISCRETE; VOLTAGE: 1/16W; Tolerance: 5%; MFG_NAME01: FENGHUA; MFG_PN01: RC-02000FT; CAD_APPROVED: Yes; FPLIST: RC0402_25,RC0402_HD,RC0402_X2,0402_CC; Value: 0R; HEIGHT: 0.45 MM; ROHS: Yes; PCB Footprint: R0402
R2817 = RES: 0402,0Ohm,+/-1%; Part Reference: R2817; CLASS: DISCRETE; VOLTAGE: 1/16W; Tolerance: 5%; MFG_NAME01: FENGHUA; MFG_PN01: RC-02000FT; CAD_APPROVED: Yes; FPLIST: RC0402_25,RC0402_HD,RC0402_X2,0402_CC; Value: 0R; HEIGHT: 0.45 MM; ROHS: Yes; PCB Footprint: R0402
R2818 = RES: 0402,0Ohm,+/-1%; Part Reference: R2818; CLASS: DISCRETE; VOLTAGE: 1/16W; Tolerance: 5%; MFG_NAME01: FENGHUA; MFG_PN01: RC-02000FT; CAD_APPROVED: Yes; FPLIST: RC0402_25,RC0402_HD,RC0402_X2,0402_CC; Value: 0R; HEIGHT: 0.45 MM; ROHS: Yes; PCB Footprint: R0402
R2819 = RES: 0402,0Ohm,+/-1%; Part Reference: R2819; CLASS: DISCRETE; FPLIST: RC0402_25,RC0402_HD,RC0402_X2,0402_CC; CAD_APPROVED: Yes; MFG_PN01: RC-02000FT; MFG_NAME01: FENGHUA; Tolerance: 5%; VOLTAGE: 1/16W; Value: 0R; ROHS: Yes; HEIGHT: 0.45 MM; PCB Footprint: R0402
R2820 = RES: 0402,0Ohm,+/-1%; Part Reference: R2820; CLASS: DISCRETE; VOLTAGE: 1/16W; Tolerance: 5%; MFG_NAME01: FENGHUA; MFG_PN01: RC-02000FT; CAD_APPROVED: Yes; FPLIST: RC0402_25,RC0402_HD,RC0402_X2,0402_CC; Value: 0R; HEIGHT: 0.45 MM; ROHS: Yes; PCB Footprint: R0402
R2821 = RES: 0402,0Ohm,+/-1%; Part Reference: R2821; CLASS: DISCRETE; FPLIST: RC0402_25,RC0402_HD,RC0402_X2,0402_CC; CAD_APPROVED: Yes; MFG_PN01: RC-02000FT; MFG_NAME01: FENGHUA; Tolerance: 5%; VOLTAGE: 1/16W; Value: 0R; ROHS: Yes; HEIGHT: 0.45 MM; PCB Footprint: R0402
R2822 = RES: 0402,10K,+/-1%; Part Reference: R2822; CLASS: DISCRETE; FPLIST: RC0402_25,RC0402_HD,0402_CC; CAD_APPROVED: Yes; MFG_PN01: RC-02W1002FT; MFG_NAME01: FENGHUA; Value: 10K; HEIGHT: 0.4 MM; ROHS: Yes; PCB Footprint: R0402
R2823 = RES: 0402,10K,+/-1%; Part Reference: R2823; CLASS: DISCRETE; FPLIST: RC0402_25,RC0402_HD,0402_CC; CAD_APPROVED: Yes; MFG_PN01: RC-02W1002FT; MFG_NAME01: FENGHUA; Value: 10K; HEIGHT: 0.4 MM; ROHS: Yes; PCB Footprint: R0402
R2824 = RES: 0402,0Ohm,+/-1%; Part Reference: R2824; CLASS: DISCRETE; VOLTAGE: 1/16W; Tolerance: 5%; MFG_NAME01: FENGHUA; MFG_PN01: RC-02000FT; CAD_APPROVED: Yes; FPLIST: RC0402_25,RC0402_HD,RC0402_X2,0402_CC; Value: 0R; HEIGHT: 0.45 MM; ROHS: Yes; PCB Footprint: R0402
R2825 = RES: 0402,0Ohm,+/-1%; Part Reference: R2825; CLASS: DISCRETE; VOLTAGE: 1/16W; Tolerance: 5%; MFG_NAME01: FENGHUA; MFG_PN01: RC-02000FT; CAD_APPROVED: Yes; FPLIST: RC0402_25,RC0402_HD,RC0402_X2,0402_CC; Value: 0R; HEIGHT: 0.45 MM; ROHS: Yes; PCB Footprint: R0402
R2826 = RES: 0402,0Ohm,+/-1%; Part Reference: R2826; CLASS: DISCRETE; VOLTAGE: 1/16W; Tolerance: 5%; MFG_NAME01: FENGHUA; MFG_PN01: RC-02000FT; CAD_APPROVED: Yes; FPLIST: RC0402_25,RC0402_HD,RC0402_X2,0402_CC; Value: 0R; HEIGHT: 0.45 MM; ROHS: Yes; PCB Footprint: R0402
R2827 = RES: 0402,0Ohm,+/-1%; Part Reference: R2827; CLASS: DISCRETE; VOLTAGE: 1/16W; Tolerance: 5%; MFG_NAME01: FENGHUA; MFG_PN01: RC-02000FT; CAD_APPROVED: Yes; FPLIST: RC0402_25,RC0402_HD,RC0402_X2,0402_CC; Value: 0R; HEIGHT: 0.45 MM; ROHS: Yes; PCB Footprint: R0402
R2828 = RES: 0402,0Ohm,+/-1%; Part Reference: R2828; CLASS: DISCRETE; VOLTAGE: 1/16W; Tolerance: 5%; MFG_NAME01: FENGHUA; MFG_PN01: RC-02000FT; CAD_APPROVED: Yes; FPLIST: RC0402_25,RC0402_HD,RC0402_X2,0402_CC; Value: 0R; HEIGHT: 0.45 MM; ROHS: Yes; PCB Footprint: R0402
R2829 = RES: 0402,0Ohm,+/-1%; Part Reference: R2829; CLASS: DISCRETE; VOLTAGE: 1/16W; Tolerance: 5%; MFG_NAME01: FENGHUA; MFG_PN01: RC-02000FT; CAD_APPROVED: Yes; FPLIST: RC0402_25,RC0402_HD,RC0402_X2,0402_CC; Value: 0R; HEIGHT: 0.45 MM; ROHS: Yes; PCB Footprint: R0402
R2830 = RES: 0402,0Ohm,+/-1%; Part Reference: R2830; CLASS: DISCRETE; VOLTAGE: 1/16W; Tolerance: 5%; MFG_NAME01: FENGHUA; MFG_PN01: RC-02000FT; CAD_APPROVED: Yes; FPLIST: RC0402_25,RC0402_HD,RC0402_X2,0402_CC; Value: 0R; HEIGHT: 0.45 MM; ROHS: Yes; PCB Footprint: R0402
R2831 = RES: 0201,1K,+/-1%; Part Reference: R2831; CLASS: DISCRETE; FPLIST: RC0402_25,RC0402_HD,RC0402_X2,0402_CC,CAPC0402_L; CAD_APPROVED: Yes; MFG_PN01: RC-01W1001FT; MFG_NAME01: FENGHUA; Value: 1K; ROHS: Yes; HEIGHT: 0.41mm; PCB Footprint: R0201
R2832 = RES: 0402,0Ohm,+/-1%; Part Reference: R2832; CLASS: DISCRETE; VOLTAGE: 1/16W; Tolerance: 5%; MFG_NAME01: FENGHUA; MFG_PN01: RC-02000FT; CAD_APPROVED: Yes; FPLIST: RC0402_25,RC0402_HD,RC0402_X2,0402_CC; Value: 0R; HEIGHT: 0.45 MM; ROHS: Yes; PCB Footprint: R0402
R2833 = RES: 0402,0Ohm,+/-1%; Part Reference: R2833; CLASS: DISCRETE; VOLTAGE: 1/16W; Tolerance: 5%; MFG_NAME01: FENGHUA; MFG_PN01: RC-02000FT; CAD_APPROVED: Yes; FPLIST: RC0402_25,RC0402_HD,RC0402_X2,0402_CC; Value: 0R; HEIGHT: 0.45 MM; ROHS: Yes; PCB Footprint: R0402
R2834 = RES: 0402,0Ohm,+/-1%; Part Reference: R2834; CLASS: DISCRETE; FPLIST: RC0402_25,RC0402_HD,RC0402_X2,0402_CC; CAD_APPROVED: Yes; MFG_PN01: RC-02000FT; MFG_NAME01: FENGHUA; Tolerance: 5%; VOLTAGE: 1/16W; Value: 0R; ROHS: Yes; HEIGHT: 0.45 MM; PCB Footprint: R0402
R2835 = RES: 0402,0Ohm,+/-1%; Part Reference: R2835; CLASS: DISCRETE; VOLTAGE: 1/16W; Tolerance: 5%; MFG_NAME01: FENGHUA; MFG_PN01: RC-02000FT; CAD_APPROVED: Yes; FPLIST: RC0402_25,RC0402_HD,RC0402_X2,0402_CC; Value: 0R; HEIGHT: 0.45 MM; ROHS: Yes; PCB Footprint: R0402
R2836 = RES: 0402,0Ohm,+/-1%; Part Reference: R2836; CLASS: DISCRETE; FPLIST: RC0402_25,RC0402_HD,RC0402_X2,0402_CC; CAD_APPROVED: Yes; MFG_PN01: RC-02000FT; MFG_NAME01: FENGHUA; Tolerance: 5%; VOLTAGE: 1/16W; Value: 0R; ROHS: Yes; HEIGHT: 0.45 MM; PCB Footprint: R0402
R2837 = RES: 0402,0Ohm,+/-1%; Part Reference: R2837; CLASS: DISCRETE; VOLTAGE: 1/16W; Tolerance: 5%; MFG_NAME01: FENGHUA; MFG_PN01: RC-02000FT; CAD_APPROVED: Yes; FPLIST: RC0402_25,RC0402_HD,RC0402_X2,0402_CC; Value: 0R; HEIGHT: 0.45 MM; ROHS: Yes; PCB Footprint: R0402
R2838 = RES: 0402,0Ohm,+/-1%; Part Reference: R2838; CLASS: DISCRETE; VOLTAGE: 1/16W; Tolerance: 5%; MFG_NAME01: FENGHUA; MFG_PN01: RC-02000FT; CAD_APPROVED: Yes; FPLIST: RC0402_25,RC0402_HD,RC0402_X2,0402_CC; Value: 0R; HEIGHT: 0.45 MM; ROHS: Yes; PCB Footprint: R0402
R2839 = RES: 0402,0Ohm,+/-1%; Part Reference: R2839; CLASS: DISCRETE; VOLTAGE: 1/16W; Tolerance: 5%; MFG_NAME01: FENGHUA; MFG_PN01: RC-02000FT; CAD_APPROVED: Yes; FPLIST: RC0402_25,RC0402_HD,RC0402_X2,0402_CC; Value: 0R; HEIGHT: 0.45 MM; ROHS: Yes; PCB Footprint: R0402
R2840 = RES: 0201,1K,+/-1%; Part Reference: R2840; CLASS: DISCRETE; MFG_NAME01: FENGHUA; MFG_PN01: RC-01W1001FT; CAD_APPROVED: Yes; FPLIST: RC0402_25,RC0402_HD,RC0402_X2,0402_CC,CAPC0402_L; Value: 1K; HEIGHT: 0.41mm; ROHS: Yes; PCB Footprint: R0201
R2841 = RES: 0402,0Ohm,+/-1%; Part Reference: R2841; CLASS: DISCRETE; FPLIST: RC0402_25,RC0402_HD,RC0402_X2,0402_CC; CAD_APPROVED: Yes; MFG_PN01: RC-02000FT; MFG_NAME01: FENGHUA; Tolerance: 5%; VOLTAGE: 1/16W; Value: 0R; ROHS: Yes; HEIGHT: 0.45 MM; PCB Footprint: R0402
R2850 = RES: 0402,4.7K,+/-1%; Part Reference: R2850; CLASS: DISCRETE; FPLIST: RC0402_25,RC0402_HD,0402_CC,RC0402_X2; CAD_APPROVED: Yes; MFG_PN01: RC-02K4701FT; MFG_NAME01: FENGHUA; Value: 4.7K; HEIGHT: 0.41mm; ROHS: Yes; PCB Footprint: R0402
R2851 = RES: 0402,0Ohm,+/-1%; Part Reference: R2851; CLASS: DISCRETE; VOLTAGE: 1/16W; Tolerance: 5%; MFG_NAME01: FENGHUA; MFG_PN01: RC-02000FT; CAD_APPROVED: Yes; FPLIST: RC0402_25,RC0402_HD,RC0402_X2,0402_CC; Value: 0R; HEIGHT: 0.45 MM; ROHS: Yes; PCB Footprint: R0402
R2852 = RES: 0201,0Ohm,+/-5%; Part Reference: R2852; CLASS: DISCRETE; VOLTAGE: 1/16W; Tolerance: 5%; MFG_NAME01: FENGHUA; MFG_PN01: RC-01000JT; CAD_APPROVED: Yes; FPLIST: RC0402_25,RC0402_HD,RC0402_X2,0402_CC; Value: 0R; HEIGHT: 0.45 MM; ROHS: Yes; PCB Footprint: R0201
R2853 = RES: 0402,0Ohm,+/-1%; Part Reference: R2853; CLASS: DISCRETE; FPLIST: RC0402_25,RC0402_HD,RC0402_X2,0402_CC; CAD_APPROVED: Yes; MFG_PN01: RC-02000FT; MFG_NAME01: FENGHUA; Tolerance: 5%; VOLTAGE: 1/16W; Value: 0R; ROHS: Yes; HEIGHT: 0.45 MM; PCB Footprint: R0402
R2854 = RES: 0402,0Ohm,+/-1%; Part Reference: R2854; CLASS: DISCRETE; VOLTAGE: 1/16W; Tolerance: 5%; MFG_NAME01: FENGHUA; MFG_PN01: RC-02000FT; CAD_APPROVED: Yes; FPLIST: RC0402_25,RC0402_HD,RC0402_X2,0402_CC; Value: 0R; HEIGHT: 0.45 MM; ROHS: Yes; PCB Footprint: R0402
R2855 = RES: 0402,0Ohm,+/-1%; Part Reference: R2855; CLASS: DISCRETE; VOLTAGE: 1/16W; Tolerance: 5%; MFG_NAME01: FENGHUA; MFG_PN01: RC-02000FT; CAD_APPROVED: Yes; FPLIST: RC0402_25,RC0402_HD,RC0402_X2,0402_CC; Value: 0R; HEIGHT: 0.45 MM; ROHS: Yes; PCB Footprint: R0402
R2856 = RES: 0201,0Ohm,+/-5%; Part Reference: R2856; CLASS: DISCRETE; FPLIST: RC0402_25,RC0402_HD,RC0402_X2,0402_CC; CAD_APPROVED: Yes; MFG_PN01: RC-01000JT; MFG_NAME01: FENGHUA; Tolerance: 5%; VOLTAGE: 1/16W; Value: 0R; ROHS: Yes; HEIGHT: 0.45 MM; PCB Footprint: R0201
R2857 = RES: 0201,0Ohm,+/-5%; Part Reference: R2857; CLASS: DISCRETE; FPLIST: RC0402_25,RC0402_HD,RC0402_X2,0402_CC; CAD_APPROVED: Yes; MFG_PN01: RC-01000JT; MFG_NAME01: FENGHUA; Tolerance: 5%; VOLTAGE: 1/16W; Value: 0R; ROHS: Yes; HEIGHT: 0.45 MM; PCB Footprint: R0201
R2858 = RES: 0201,0Ohm,+/-5%; Part Reference: R2858; CLASS: DISCRETE; VOLTAGE: 1/16W; Tolerance: 5%; MFG_NAME01: FENGHUA; MFG_PN01: RC-01000JT; CAD_APPROVED: Yes; FPLIST: RC0402_25,RC0402_HD,RC0402_X2,0402_CC; Value: 0R; HEIGHT: 0.45 MM; ROHS: Yes; PCB Footprint: R0201
R2859 = RES: 0201,10K,+/-5%; Part Reference: R2859; CLASS: DISCRETE; FPLIST: RC0402_25,RC0402_HD,0402_CC; CAD_APPROVED: Yes; MFG_PN01: RC-01W103JT; MFG_NAME01: FENGHUA; Value: 10K; HEIGHT: 0.4 MM; ROHS: Yes; PCB Footprint: R0201
R2860 = RES: 0402,0Ohm,+/-1%; Part Reference: R2860; CLASS: DISCRETE; FPLIST: RC0402_25,RC0402_HD,RC0402_X2,0402_CC; CAD_APPROVED: Yes; MFG_PN01: RC-02000FT; MFG_NAME01: FENGHUA; Tolerance: 5%; VOLTAGE: 1/16W; Value: 0R; ROHS: Yes; HEIGHT: 0.45 MM; PCB Footprint: R0402
R2861 = RES: 0201,0Ohm,+/-5%; Part Reference: R2861; CLASS: DISCRETE; FPLIST: RC0402_25,RC0402_HD,RC0402_X2,0402_CC; CAD_APPROVED: Yes; MFG_PN01: RC-01000JT; MFG_NAME01: FENGHUA; Tolerance: 5%; VOLTAGE: 1/16W; Value: 0R; ROHS: Yes; HEIGHT: 0.45 MM; PCB Footprint: R0201
R2862 = RES: 0201,10K,+/-5%; Part Reference: R2862; CLASS: DISCRETE; FPLIST: RC0402_25,RC0402_HD,0402_CC; CAD_APPROVED: Yes; MFG_PN01: RC-01W103JT; MFG_NAME01: FENGHUA; Value: 10K; HEIGHT: 0.4 MM; ROHS: Yes; PCB Footprint: R0201
R2863 = RES: 0201,0Ohm,+/-5%; Part Reference: R2863; CLASS: DISCRETE; FPLIST: RC0402_25,RC0402_HD,RC0402_X2,0402_CC; CAD_APPROVED: Yes; MFG_PN01: RC-01000JT; MFG_NAME01: FENGHUA; Tolerance: 5%; VOLTAGE: 1/16W; Value: 0R; ROHS: Yes; HEIGHT: 0.45 MM; PCB Footprint: R0201
R2864 = RES: 0201,100Ohm,+/-1%; Part Reference: R2864; CLASS: DISCRETE; MFG_PN01: RC-01W1000FT; MFG_NAME01: FENGHUA; Temp Range: -55¡ãC to +175¡ãC; CAD_APPROVED: Yes; Tolerance: 5%; FPLIST: RC0402_25,RC0402_HD,RC0402_X2,0402_CC; Value: 100R; ROHS: Yes; HEIGHT: 0.45MM; PCB Footprint: R0201
R2865 = RES: 0201,0Ohm,+/-5%; Part Reference: R2865; CLASS: DISCRETE; FPLIST: RC0402_25,RC0402_HD,RC0402_X2,0402_CC; CAD_APPROVED: Yes; MFG_PN01: RC-01000JT; MFG_NAME01: FENGHUA; Tolerance: 5%; VOLTAGE: 1/16W; Value: 0R; ROHS: Yes; HEIGHT: 0.45 MM; PCB Footprint: R0201
R2866 = RES: 0402,0Ohm,+/-1%; Part Reference: R2866; CLASS: DISCRETE; FPLIST: RC0402_25,RC0402_HD,RC0402_X2,0402_CC; CAD_APPROVED: Yes; MFG_PN01: RC-02000FT; MFG_NAME01: FENGHUA; Tolerance: 5%; VOLTAGE: 1/16W; Value: 0R; ROHS: Yes; HEIGHT: 0.45 MM; PCB Footprint: R0402
R2867 = RES: 0402,0Ohm,+/-1%; Part Reference: R2867; CLASS: DISCRETE; VOLTAGE: 1/16W; Tolerance: 5%; MFG_NAME01: FENGHUA; MFG_PN01: RC-02000FT; CAD_APPROVED: Yes; FPLIST: RC0402_25,RC0402_HD,RC0402_X2,0402_CC; Value: 0R; HEIGHT: 0.45 MM; ROHS: Yes; PCB Footprint: R0402
R2868 = RES: 0201,0Ohm,+/-5%; Part Reference: R2868; CLASS: DISCRETE; FPLIST: RC0402_25,RC0402_HD,RC0402_X2,0402_CC; CAD_APPROVED: Yes; MFG_PN01: RC-01000JT; MFG_NAME01: FENGHUA; Tolerance: 5%; VOLTAGE: 1/16W; Value: 0R; ROHS: Yes; HEIGHT: 0.45 MM; PCB Footprint: R0201
R2870 = RES: 0402,0Ohm,+/-1%; Part Reference: R2870; CLASS: DISCRETE; VOLTAGE: 1/16W; Tolerance: 5%; MFG_NAME01: FENGHUA; MFG_PN01: RC-02000FT; CAD_APPROVED: Yes; FPLIST: RC0402_25,RC0402_HD,RC0402_X2,0402_CC; Value: 0R; HEIGHT: 0.45 MM; ROHS: Yes; PCB Footprint: R0402
R2871 = RES: 0402,0Ohm,+/-1%; Part Reference: R2871; CLASS: DISCRETE; VOLTAGE: 1/16W; Tolerance: 5%; MFG_NAME01: FENGHUA; MFG_PN01: RC-02000FT; CAD_APPROVED: Yes; FPLIST: RC0402_25,RC0402_HD,RC0402_X2,0402_CC; Value: 0R; HEIGHT: 0.45 MM; ROHS: Yes; PCB Footprint: R0402
R2873 = RES: 0201,10K,+/-5%; Part Reference: R2873; CLASS: DISCRETE; MFG_NAME01: FENGHUA; MFG_PN01: RC-01W103JT; CAD_APPROVED: Yes; FPLIST: RC0402_25,RC0402_HD,0402_CC; Value: 10K; ROHS: Yes; HEIGHT: 0.4 MM; PCB Footprint: R0201
R2954 = RES: 0201,10K,+/-5%; Part Reference: R2954; CLASS: DISCRETE; FPLIST: RC0402_25,RC0402_HD,0402_CC; CAD_APPROVED: Yes; MFG_PN01: RC-01W103JT; MFG_NAME01: FENGHUA; Value: 10K; HEIGHT: 0.4 MM; ROHS: Yes; PCB Footprint: R0201
R2955 = RES: 0201,0Ohm,+/-5%; Part Reference: R2955; CLASS: DISCRETE; FPLIST: RC0402_25,RC0402_HD,RC0402_X2,0402_CC; CAD_APPROVED: Yes; MFG_PN01: RC-01000JT; MFG_NAME01: FENGHUA; Tolerance: 5%; VOLTAGE: 1/16W; Value: 0R; ROHS: Yes; HEIGHT: 0.45 MM; PCB Footprint: R0201
R2956 = RES: 0201,100K,+/-1%; Part Reference: R2956; CLASS: DISCRETE; Tolerance: 5%; MFG_NAME01: FENGHUA; MFG_PN01: RC-01W1003FT; CAD_APPROVED: Yes; FPLIST: RC0402_25,RC0402_HD,0402_CC; Value: 100K; ROHS: Yes; HEIGHT: 0.4 MM; PCB Footprint: R0201
R2957 = RES: 0201,10K,+/-5%; Part Reference: R2957; CLASS: DISCRETE; FPLIST: RC0402_25,RC0402_HD,0402_CC; CAD_APPROVED: Yes; MFG_PN01: RC-01W103JT; MFG_NAME01: FENGHUA; Value: 10K; HEIGHT: 0.4 MM; ROHS: Yes; PCB Footprint: R0201
R2958 = RES: 0201,10K,+/-5%; Part Reference: R2958; CLASS: DISCRETE; MFG_NAME01: FENGHUA; MFG_PN01: RC-01W103JT; CAD_APPROVED: Yes; FPLIST: RC0402_25,RC0402_HD,0402_CC; Value: 10K; ROHS: Yes; HEIGHT: 0.4 MM; PCB Footprint: R0201
R2959 = RES: 0201,0Ohm,+/-5%; Part Reference: R2959; CLASS: DISCRETE; VOLTAGE: 1/16W; Tolerance: 5%; MFG_NAME01: FENGHUA; MFG_PN01: RC-01000JT; CAD_APPROVED: Yes; FPLIST: RC0402_25,RC0402_HD,RC0402_X2,0402_CC; Value: 0R; HEIGHT: 0.45 MM; ROHS: Yes; PCB Footprint: R0201
R2960 = RES: 0201,100K,+/-1%; Part Reference: R2960; CLASS: DISCRETE; Tolerance: 5%; MFG_NAME01: FENGHUA; MFG_PN01: RC-01W1003FT; CAD_APPROVED: Yes; FPLIST: RC0402_25,RC0402_HD,0402_CC; Value: 100K; ROHS: Yes; HEIGHT: 0.4 MM; PCB Footprint: R0201
R2961 = RES: 0201,0Ohm,+/-5%; Part Reference: R2961; CLASS: DISCRETE; FPLIST: RC0402_25,RC0402_HD,RC0402_X2,0402_CC; CAD_APPROVED: Yes; MFG_PN01: RC-01000JT; MFG_NAME01: FENGHUA; Tolerance: 5%; VOLTAGE: 1/16W; Value: 0R; ROHS: Yes; HEIGHT: 0.45 MM; PCB Footprint: R0201
R3017 = RES: 0402,0Ohm,+/-1%; Part Reference: R3017; CLASS: DISCRETE; VOLTAGE: 1/16W; Tolerance: 5%; MFG_NAME01: FENGHUA; MFG_PN01: RC-02000FT; CAD_APPROVED: Yes; FPLIST: RC0402_25,RC0402_HD,RC0402_X2,0402_CC; Value: 0R; HEIGHT: 0.45 MM; ROHS: Yes; PCB Footprint: R0402
R3018 = RES: 0402,0Ohm,+/-1%; Part Reference: R3018; CLASS: DISCRETE; FPLIST: RC0402_25,RC0402_HD,RC0402_X2,0402_CC; CAD_APPROVED: Yes; MFG_PN01: RC-02000FT; MFG_NAME01: FENGHUA; Tolerance: 5%; VOLTAGE: 1/16W; Value: 0R; ROHS: Yes; HEIGHT: 0.45 MM; PCB Footprint: R0402
R3028 = RES: 0402,0Ohm,+/-1%; Part Reference: R3028; CLASS: DISCRETE; FPLIST: RC0402_25,RC0402_HD,RC0402_X2,0402_CC; CAD_APPROVED: Yes; MFG_PN01: RC-02000FT; MFG_NAME01: FENGHUA; Tolerance: 5%; VOLTAGE: 1/16W; Value: 0R; ROHS: Yes; HEIGHT: 0.45 MM; PCB Footprint: R0402
R3031 = RES: 0201,10K,+/-5%; Part Reference: R3031; CLASS: DISCRETE; FPLIST: RC0402_25,RC0402_HD,0402_CC; CAD_APPROVED: Yes; MFG_PN01: RC-01W103JT; MFG_NAME01: FENGHUA; Value: 10K; HEIGHT: 0.4 MM; ROHS: Yes; PCB Footprint: R0201
R3037 = RES: 0402,0Ohm,+/-1%; Part Reference: R3037; CLASS: DISCRETE; VOLTAGE: 1/16W; Tolerance: 5%; MFG_NAME01: FENGHUA; MFG_PN01: RC-02000FT; CAD_APPROVED: Yes; FPLIST: RC0402_25,RC0402_HD,RC0402_X2,0402_CC; Value: 0R; HEIGHT: 0.45 MM; ROHS: Yes; PCB Footprint: R0402
R3038 = RES: 0402,0Ohm,+/-1%; Part Reference: R3038; CLASS: DISCRETE; VOLTAGE: 1/16W; Tolerance: 5%; MFG_NAME01: FENGHUA; MFG_PN01: RC-02000FT; CAD_APPROVED: Yes; FPLIST: RC0402_25,RC0402_HD,RC0402_X2,0402_CC; Value: 0R; HEIGHT: 0.45 MM; ROHS: Yes; PCB Footprint: R0402
TP934 = TESTLOOP: no part to order; Part Reference: TP934; CLASS: IO; ASSY_OPT: DNP; MFG_NAME01: NOT A COMPONENT; CAD_APPROVED: Yes; MFG_PN01: NOT A COMPONENT; ROHS: Yes; HEIGHT: 0.1MM; PCB Footprint: tpad_015
U726 = MP2147GD_QFN_11P: Part Reference: U726; CLASS: IC; CAD_APPROVED: Yes; MFG_NAME01: MPS; Value: MP2147GD; HEIGHT: 1MM; ROHS: Yes; MFG_PN01: MP2147GD; PCB Footprint: qfn12_0p5_2x3mm_ep
U728 = TXB0304RUT_12P_B_0: 74AVC4T3144GU12,XQFN12,1.70*2.0,4-bit dual-supply buffer/level translator;3-state; Part Reference: U728; CLASS: IC; CAD_APPROVED: Yes; VOLTAGE: 0.9-3.6V; MFG_NAME01: NXP; 3D_Mechanical_Footprint_File: ftp://fcl.am.freescale.net/ALLEGRO/step/uqfn12_1p7x2mm.STEP; Value: 74AVC4T3144; HEIGHT: 0.55 MM; ROHS: Yes; MFG_PN01: 74AVC4T3144; PCB Footprint: uqfn12_1p7x2mm
U729 = TXB0304RUT_12P_B_0: 74AVC4T3144GU12,XQFN12,1.70*2.0,4-bit dual-supply buffer/level translator;3-state; Part Reference: U729; CLASS: IC; 3D_Mechanical_Footprint_File: ftp://fcl.am.freescale.net/ALLEGRO/step/uqfn12_1p7x2mm.STEP; MFG_NAME01: NXP; VOLTAGE: 0.9-3.6V; CAD_APPROVED: Yes; Value: 74AVC4T3144; MFG_PN01: 74AVC4T3144; ROHS: Yes; HEIGHT: 0.55 MM; PCB Footprint: uqfn12_1p7x2mm